# Altium project TAUV-Modem.PrjPcb
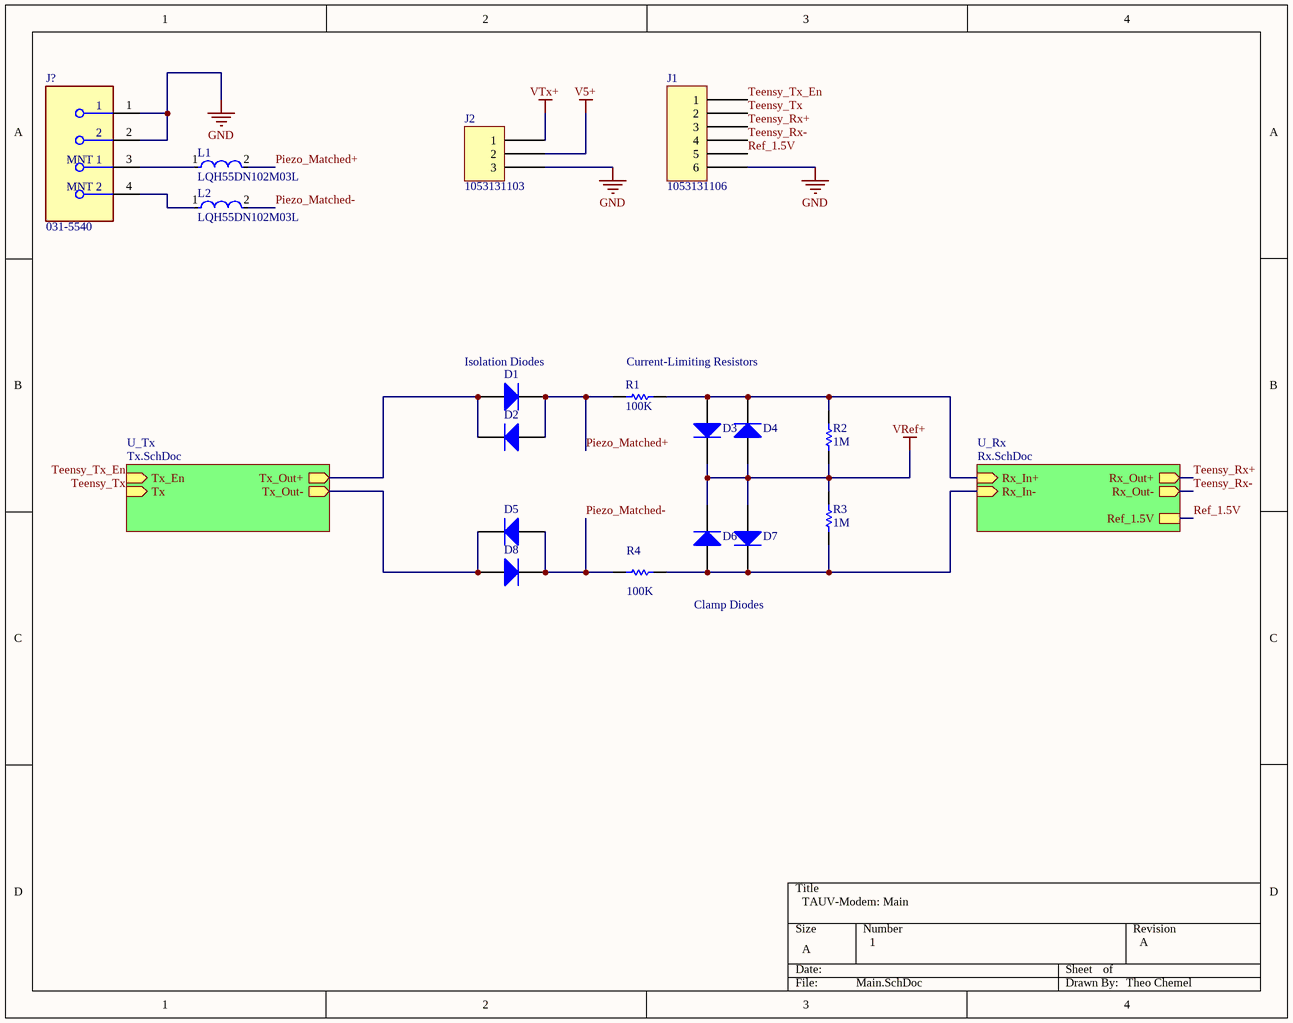
[diagram p0: Main.SchDoc]
3 sheets, 79 parts. Net scope: hierarchical (ports join the sheet entries above them; power ports are global).
Board file: TAUV-Modem-Board.PcbDoc
Sheets:
  Main.SchDoc
    U_Tx = Tx.SchDoc
    U_Rx = Rx.SchDoc

## Sheet Main.SchDoc: TAUV-Modem: Main
size A; DrawnBy: Theo Chemel; Revision: A; SheetNumber: 1; SheetTotal: 3

### Parts
D1  Diode  [SOD-123F]  (value not drawn)
D2  Diode  [SOD-123F]  (value not drawn)
D3  Diode  [SOD-123F]  (value not drawn)
D4  Diode  [SOD-123F]  (value not drawn)
D5  Diode  [SOD-123F]  (value not drawn)
D6  Diode  [SOD-123F]  (value not drawn)
D7  Diode  [SOD-123F]  (value not drawn)
D8  Diode  [SOD-123F]  (value not drawn)
J1  1053131106  [MOLEX 1053131106]
J2  1053131103  [MOLEX 1053131103]
J3  031-5540  [FP-031-5540-MFG]
L1  LQH55DN102M03L  [FP-LQH55DN_03-MFG]
L2  LQH55DN102M03L  [FP-LQH55DN_03-MFG]
R1  value 100K  [0805]  (hidden comment: Resistor)
R2  value 1M  [0805]  (hidden comment: Resistor)
R3  value 1M  [0805]  (hidden comment: Resistor)
R4  value 100K  [0805]  (hidden comment: Resistor)

### Sub-sheets
U_Rx = Rx.SchDoc: Rx_In+ (in), Rx_In- (in), Ref_1.5V, Rx_Out+ (out), Rx_Out- (out)
U_Tx = Tx.SchDoc: Tx_En (in), Tx (in), Tx_Out+ (out), Tx_Out- (out)

### Nets
GND: J1.6 J2.3 J3.1 J3.2
V5+: J2.2
VRef+: D3.2(K) D4.1(A) D6.2(K) D7.1(A) R2.1 R3.2
VTx+: J2.1
Piezo_Matched+: D1.2(K) D2.1(A) L1.2 R1.1
Piezo_Matched-: D5.1(A) D8.2(K) L2.2 R4.1
Ref_1.5V: J1.5 ; sheet U_Rx/Ref_1.5V  [project net AD8338_VREF]
Teensy_Rx+: J1.3 ; sheet U_Rx/Rx_Out+  [project net Rx_Out+]
Teensy_Rx-: J1.4 ; sheet U_Rx/Rx_Out-  [project net Rx_Out-]
Teensy_Tx: J1.2 ; sheet U_Tx/Tx
Teensy_Tx_En: J1.1 ; sheet U_Tx/Tx_En
Tx_Out+: D1.1(A) D2.2(K) ; sheet U_Tx/Tx_Out+
Tx_Out-: D5.2(K) D8.1(A) ; sheet U_Tx/Tx_Out-
NetD3_1: D3.1(A) D4.2(K) R1.2 R2.2 ; sheet U_Rx/Rx_In+
NetD6_1: D6.1(A) D7.2(K) R3.1 R4.2 ; sheet U_Rx/Rx_In-
NetJ3_3: J3.3(MNT_1) L1.1
NetJ3_4: J3.4(MNT_2) L2.1

### Notes on the sheet
- (near D1) Isolation Diodes
- (near R1) Current-Limiting Resistors
- Clamp Diodes

### Library data of the parts
D1-D8 = Diode: AF: 1; BV: 0; BV_MAX: 1e99; EG: 1.11; FC: 0.5; IBV: 0.001; ISR: 1e-14; MJSW: 0.33; NTUN: 30; TNOM: 27; XTI: 3; SimulationGenericComponent: True; CJO: 0; CJP: 0; CTA: 0; CTP: 0; FCS: 0.5; FV_MAX: 1e99; IKF: 0; IKR: 0; JSW: 0; JTUN: 0; JTUNSW: 0; KEG: 1; KF: 0; LEVEL: 1; N: 1; NBV: 1; NR: 1; NS: 1; PHP: 1; RS: 0; TCV: 0; TLEV: 0; TLEVC: 0; TM1: 0; TM2: 0; TPB: 0; TPHP: 0; TRS: 0; TRS2: 0; TT: 0; TTT1: 0; TTT2: 0; VJ: 1; XTITUN: 3; IS: 1e-14
J1 = 1053131106: CONN HEADER R/A 6POS 2.5MM; Manufacturer: Molex; Contact Length - Post: 0.126" (3.20mm); Number of Positions: 6; Number of Positions Loaded: All; Pitch - Mating: 0.098" (2.50mm); Row Spacing - Mating: -40°C ~ 105°C; Shrouding: Shrouded - 4 Wall; Style: Board to Cable/Wire; Part Number: 1053131106; ComponentLink1Description: Datasheet; ComponentLink1URL: https://www.molex.com/pdm_docs/ps/PS-105300-100-001.pdf; ComponentLink2Description: DigiKey Link; ComponentLink2URL: https://www.digikey.com/en/products/detail/molex/1053131106/7693178; Connector Type: Header; Contact Finish - Mating: Tin; Contact Finish - Post: Tin; Contact Finish Thickness - Mating: 59.0µin (1.50µm); Contact Material: Brass; Contact Shape: Square; Contact Type: Male Pin; Fastening Type: Latch Holder; Features: Board Guide; Insulation Color: Black; Insulation Height: 0.149" (3.78mm); Insulation Material: Liquid Crystal Polymer (LCP); LastUpdated: 8/11/2022 9:49:49 AM; Lifecycle Status: Active; Minimum Order: 1; Mounting Type: Through Hole, Right Angle; Number of Rows: 1; Operating Temperature: -40°C ~ 105°C; Packaging: Tray; PartId: 145; Part Status: Active; Price: 0.75; Series: Nano-Fit 105313; Supplier 1: DigiKey; Supplier Part Number 1: WM16897-ND; Termination: Solder
J2 = 1053131103: CONN HEADER R/A 3POS 2.5MM; Manufacturer: Molex; Contact Length - Post: 0.126" (3.20mm); Number of Positions: 3; Number of Positions Loaded: All; Pitch - Mating: 0.098" (2.50mm); Row Spacing - Mating: -40°C ~ 105°C; Shrouding: Shrouded - 4 Wall; Style: Board to Cable/Wire; Part Number: 1053131103; ComponentLink1Description: Datasheet; ComponentLink1URL: http://www.literature.molex.com/SQLImages/kelmscott/Molex/PDF_Images/987651-1223.PDF; ComponentLink2Description: DigiKey Link; ComponentLink2URL: http://digikey.com/product-detail/en/molex/1053131103/WM16894-ND/7693175; Connector Type: Header; Contact Finish - Mating: Tin; Contact Finish - Post: Tin; Contact Finish Thickness - Mating: 59.0µin (1.50µm); Contact Material: Brass; Contact Shape: Square; Contact Type: Male Pin; Fastening Type: Latch Holder; Features: Board Guide; Insulation Color: Black; Insulation Height: 0.149" (3.78mm); Insulation Material: Liquid Crystal Polymer (LCP); LastUpdated: 8/11/2022 9:48:02 AM; Lifecycle Status: Active; Minimum Order: 1; Mounting Type: Through Hole, Right Angle; Number of Rows: 1; Operating Temperature: -40°C ~ 105°C; Packaging: Tray; PartId: 142; Part Status: Active; Price: 0.95; Series: Nano-Fit 105313; Supplier 1: DigiKey; Supplier Part Number 1: WM16894-ND; Termination: Solder
J3 = CMP-20040-000002-1: CONN BNC RCPT R/A 50 OHM PCB; Manufacturer: Amphenol RF; Impedance: 50Ω; Number Of Contacts: 2; Pitch: 2.54mm; Dielectric Material: Polypropylene; Is Female: yes; Frequency: 1GHz; Conn Orientation: Right Angle; Lead Free: Yes; Device Class L2: RF / Coaxial Connectors; Digikey Description: CONN BNC RCPT R/A 50 OHM PCB; Octopart: https://octopart.com/031-5540-amphenol+rf-49742301; ComponentLink2URL: https://www.amphenolrf.com/downloads/dl/file/id/2040/product/579/031_5540_customer_drawing.pdf; Package: 0; Automotive: No; Temperature: -55°C to +85°C; Contact Material: Gold,Nickel; RoHS: TRUE; ComponentLink2Description: Datasheet; Height: 13.4mm; Category: Conn; Manufacturer Part Number: 031-5540; Temperature Range High: +85°C; Device Class L3: unset; Temperature Range Low: -55°C; Device Class L1: Connectors
L1 L2 = CMP-06042-004467-1: Wire Wound Ferrite Inductor for Power Lines 1000μH ±20% 14.42Ω  0.15A 2220; Series Resistance: 10.3R; Self Resonant Frequency: 1.7MHz; Test Frequency: 10kHz; Shielding: Unshielded; Max DC Current: 150mA; Inductance: 1mH; Weight: 0.016932oz; Tolerance: 20%; Max Operating Temperature: 80°C; DC Resistance (DCR): 10.3R; Military Standard: Not; Height - Seated (Max): 0.198inch; Radiation Hardening: No; Min Operating Temperature: -40°C; Lead Free: Lead Free; Case/Package: 2220; Width: 0.197inch; Resistor Type: Wirewound; Depth: 5.3mm; Termination: SMD/SMT; Case Code (Metric): 5750; Height: 0.197inch; Case Code (Imperial): 2220; Core Material: Ferrite; Package Quantity: 350; Mount: Surface Mount; Packaging: Tape and Reel; Current Rating: 150mA; DC Current: 150mA; Length: 0.224inch
R1-R4 = Resistor: TC1: 0; SimulationGenericComponent: True; TC2: 0

## Sheet Tx.SchDoc
size A; SheetNumber: 2; SheetTotal: 3; SPICEModelCacheFIXEDSUJ: <root> / <DocumentId>FIXEDSUJ</DocumentId> / </root>
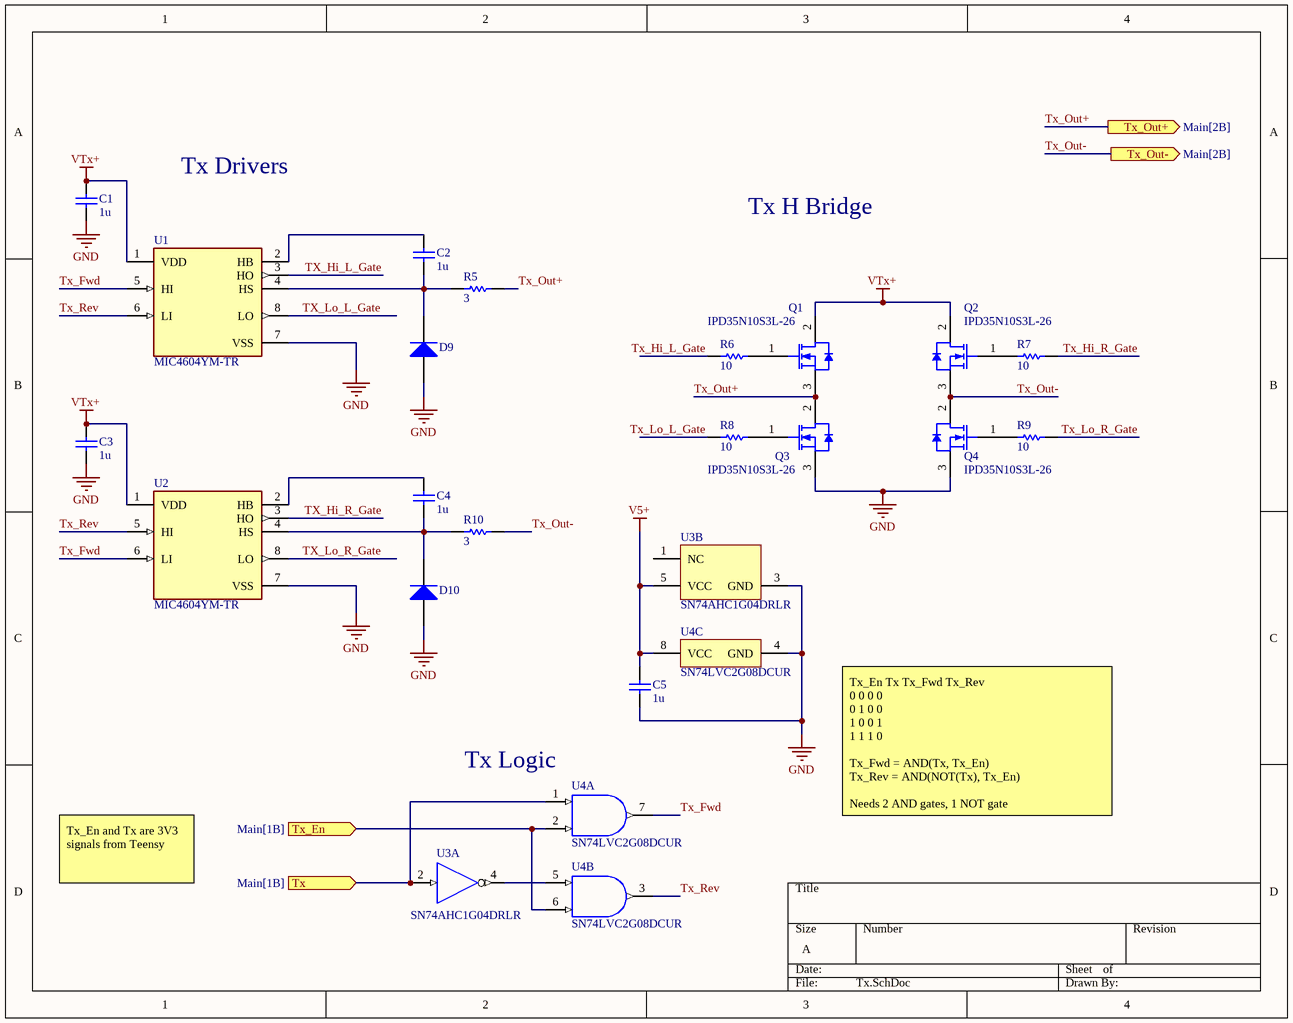
[diagram p1: Tx.SchDoc]

### Parts
C1  value 1u  [0805]  (hidden comment: Capacitor)
C2  value 1u  [0805]  (hidden comment: Capacitor)
C3  value 1u  [0805]  (hidden comment: Capacitor)
C4  value 1u  [0805]  (hidden comment: Capacitor)
C5  value 1u  [0805]  (hidden comment: Capacitor)
D9  Diode  [SOD-123F]  (value not drawn)
D10  Diode  [SOD-123F]  (value not drawn)
Q1  IPD35N10S3L-26  [INF-PG-TO252-3-11_M]
Q2  IPD35N10S3L-26  [INF-PG-TO252-3-11_M]
Q3  IPD35N10S3L-26  [INF-PG-TO252-3-11_M]
Q4  IPD35N10S3L-26  [INF-PG-TO252-3-11_M]
R5  value 3  [0805]  (hidden comment: Resistor)
R6  value 10  [0805]  (hidden comment: Resistor)
R7  value 10  [0805]  (hidden comment: Resistor)
R8  value 10  [0805]  (hidden comment: Resistor)
R9  value 10  [0805]  (hidden comment: Resistor)
R10  value 3  [0805]  (hidden comment: Resistor)
U1  MIC4604YM-TR  [FP-SOICN-8LD-PL-1-IPC_A]
U2  MIC4604YM-TR  [FP-SOICN-8LD-PL-1-IPC_A]
U3  SN74AHC1G04DRLR  [DRL0005A_M]  (parts A,B of 2)
U4  SN74LVC2G08DCUR  [DCU0008A_M]  (parts A,B,C of 3)

### Ports
Tx (in, see Main[1B]), Tx_En (in, see Main[1B]), Tx_Out+ (out, see Main[2B]), Tx_Out- (out, see Main[2B])

### Nets
GND: C1.1 C3.1 C5.1 D9.1(A) D10.1(A) Q3.3(SOURCE) Q4.3(SOURCE) U1.7(VSS) U2.7(VSS) U3.3(GND) U4.4(GND)
V5+: C5.2 U3.5(VCC) U4.8(VCC)
VTx+: C1.2 C3.2 Q1.2(DRAIN) Q2.2(DRAIN) U1.1(VDD) U2.1(VDD)
Teensy_Tx: U3.2(A) U4.1(1A) ; port Tx
Teensy_Tx_En: U4.2(1B) U4.6(2B) ; port Tx_En
Tx_Fwd: U1.5(HI) U2.6(LI) U4.7(1Y)
Tx_Hi_L_Gate: R6.1 U1.3(HO)
Tx_Hi_R_Gate: R7.2 U2.3(HO)
Tx_Lo_L_Gate: R8.1 U1.8(LO)
Tx_Lo_R_Gate: R9.2 U2.8(LO)
Tx_Out+: Q1.3(SOURCE) Q3.2(DRAIN) R5.2 ; port Tx_Out+
Tx_Out-: Q2.3(SOURCE) Q4.2(DRAIN) R10.2 ; port Tx_Out-
Tx_Rev: U1.6(LI) U2.5(HI) U4.3(2Y)
NetC2_1: C2.1 D9.2(K) R5.1 U1.4(HS)
NetC2_2: C2.2 U1.2(HB)
NetC4_1: C4.1 D10.2(K) R10.1 U2.4(HS)
NetC4_2: C4.2 U2.2(HB)
NetQ1_1: Q1.1(GATE) R6.2
NetQ2_1: Q2.1(GATE) R7.1
NetQ3_1: Q3.1(GATE) R8.2
NetQ4_1: Q4.1(GATE) R9.1
NetU3_4: U3.4(Y) U4.5(2A)

Not connected (* = marked no-connect by the designer): U3 1(NC)

### Notes on the sheet
- Tx Drivers
- Tx H Bridge
- (near U4) Tx Logic
- Tx_En Tx Tx_Fwd Tx_Rev
  0 0 0 0
  0 1 0 0
  1 0 0 1
  1 1 1 0
  Tx_Fwd = AND(Tx, Tx_En)
  Tx_Rev = AND(NOT(Tx), Tx_En)
  Needs 2 AND gates, 1 NOT gate
- Tx_En and Tx are 3V3 signals from Teensy

### Library data of the parts
C1-C5 = Capacitor: SimulationGenericComponent: True
D9 D10 = Diode: as D1 on sheet Main; CJO: 0; CJP: 0; CTA: 0; CTP: 0; FCS: 0.5; FV_MAX: 1e99; IKF: 0; IKR: 0; JSW: 0; JTUN: 0; JTUNSW: 0; KEG: 1; KF: 0; LEVEL: 1; N: 1; NBV: 1; NR: 1; NS: 1; PHP: 1; RS: 0; TCV: 0; TLEV: 0; TLEVC: 0; TM1: 0; TM2: 0; TPB: 0; TPHP: 0; TRS: 0; TRS2: 0; TT: 0; TTT1: 0; TTT2: 0; VJ: 1; XTITUN: 3; IS: 1e-14
Q1-Q4 = CMP-1138-00144-1: OptiMOS-T Power-Transistor, 100 V VDS, 35 A ID, PG-TO252-3-11, Reel, Green; Manufacturer: Infineon; VGS(th) (max): 2.4 V; ID (max): 35 A; RthJC (max): 2.1 K/W; RDS (on) (max) (@10V): 24 mOhm; VDS (max): 100 V; Green: TRUE; VGS(th) (min): 1.2 V; QG: 39 nC; RDS (on) (max) (@4.5V): 31.9 mOhm; IDpuls (max): 140 A; Ptot (max): 71 W; ComponentLink1URL: http://www.infineon.com/; ComponentLink1Description: Manufacturer URL; ComponentLink3URL: http://www.infineon.com/dgdl/BTS142_DS_13.pdf?folderId=db3a3043163797a6011667aa084c0e01&fileId=db3a3043163797a6011667ac98be0e02&location=en.Products.Automotive_ICs.Smart_High-_and_Low-Side_Switches.HITFET___TEMPFET__-_Smart_Low-Side_Switches.DATASHEET.BTS1; Packing: Reel; ComponentLink3Description: Package Specification; PackageReference: PG-TO252-3-11; ComponentLink2URL: http://www.infineon.com/dgdl/IPD35N10S3L-26_DS_1_1.pdf?folderId=db3a3043156fd5730115c7d50620107c&fileId=db3a30431a5c32f2011a9085629c594b&location=en.Products.Automotive_ICs.Automotive_MOSFETs.Single__N-Channel_100V_MOSFETs.DATASHEET.IPD35N10S3L-26_DS_1_1.p; ComponentLink2Description: Datasheet; DatasheetVersion: Rev.1.1; Mounting Technology: Surface Mount; PartNumber: IPD35N10S3L-26; PackageVersion: Dec-06; PackageDescription: 3-Pin Plastic (Green) Transistor Single Outline Package, 6.5 x 6.12 mm Body, 2.28 mm Pitch; Technology: OptiMOS-T; Halogen-free: TRUE
R5-R10 = Resistor: TC1: 0; SimulationGenericComponent: True; TC2: 0
U1 U2 = CMP-06319-000039-1: IC GATE DRVR HALF-BRIDGE 8SOIC; Min Supply Voltage: 5.5V; Max Supply Voltage: 16V; Turn-On Delay Time: 75ns; Rise Time: 20ns; Number of Drivers: 2; Operating Supply Voltage: 12V; Number of Outputs: 1; Nominal Supply Current: 48uA; Max Output Current: 1A; Channel Type: Independent; Packaging: Tape and Reel; Turn-Off Delay Time: 75ns; Number of Pins: 8; Fall Time: 20ns; Max Operating Temperature: 125°C; Min Operating Temperature: -40°C; Package Quantity: 2500; Lead Free: Lead Free; Supply Current: 48uA; Mount: Surface Mount; RoHS Compliant: Yes; Series: -; Case/Package: SOIC
U3 = CMP-0859-00797-3: Single Inverter Gate, DRL0005A, LARGE T&R; Manufacturer: Texas Instruments; VCC(Min)(V): 2; F @ Nom Voltage(Max)(Mhz): 75; VCC(Max)(V): 5.5; Output Type: CMOS; Voltage(Nom)(V): 3.3,5; Schmitt Trigger: No; Logic: Inverting; Technology Family: AHC; tpd @ Nom Voltage(Max)(ns): 10.6,7.5; Rating: Catalog; Sub-Family: Inverting Buffer/Driver; Output Drive (IOL/IOH)(Max)(mA): 50/-50; ICC @ Nom Voltage(Max)(mA): 0.01; Bits(#): 1; PackageReference: DRL0005A; Operating Temperature Range(C): -40 to 125; Input Type: CMOS; Generic Part Number: SN74AHC1G04; DatasheetVersion: SCLS318S; 3-State Output: No
U4 = CMP-0859-00670-3: Dual 2-Input Positive-AND Gate, DCU0008A, LARGE T&R; Manufacturer: Texas Instruments; Logic: True; Output Drive (IOL/IOH)(Max)(mA): 32/-32; F @ Nom Voltage(Max)(Mhz): 150; Technology Family: LVC; Rating: Catalog; tpd @ Nom Voltage(Max)(ns): 9.8,5.8,5.3,4.8; Voltage(Nom)(V): 1.8,2.5,3.3,5; Schmitt Trigger: No; Input Type: CMOS/TTL; Bits(#): 2; Gate Type: AND; VCC(Max)(V): 5.5; VCC(Min)(V): 1.65; ICC @ Nom Voltage(Max)(mA): 0.01; Output Type: CMOS; Sub-Family: AND Gate; PackageReference: DCU0008A; Operating Temperature Range(C): -40 to 125,-40 to 85; 3-State Output: No; DatasheetVersion: SCES198M; Generic Part Number: SN74LVC2G08

## Sheet Rx.SchDoc
size A; SheetNumber: 3; SheetTotal: 3
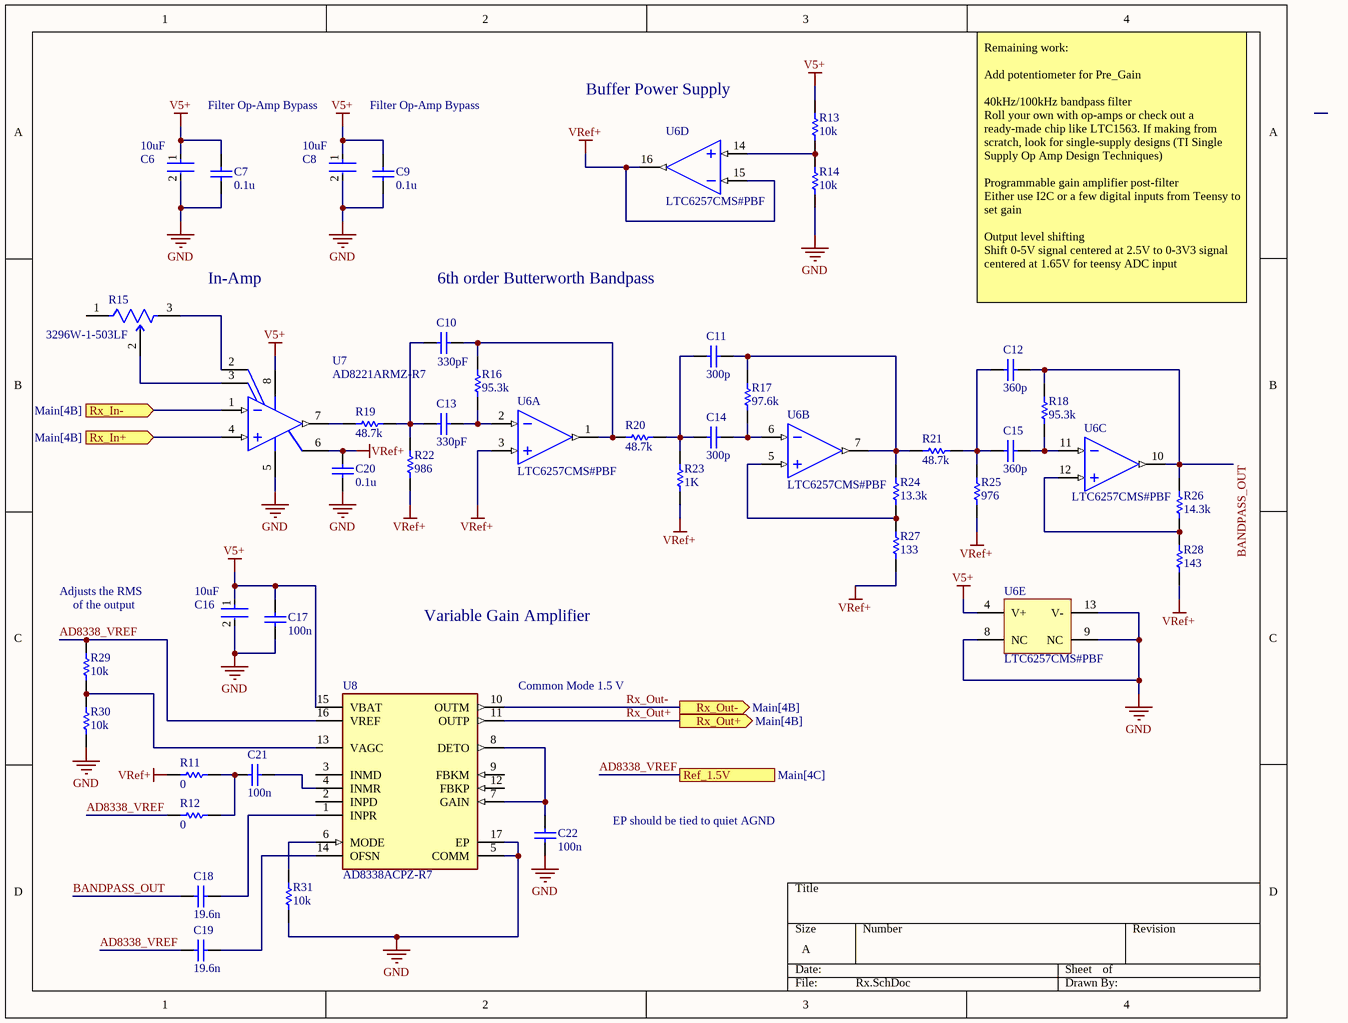
[diagram p2: Rx.SchDoc]

### Parts
C6  Capacitance: 10uF  [FP-C3216-160-0_2-IPC_A]  (hidden comment: C3216X5R1H106K160AB)
C7  value 0.1u  [0805]  (hidden comment: Capacitor)
C8  Capacitance: 10uF  [FP-C3216-160-0_2-IPC_A]  (hidden comment: C3216X5R1H106K160AB)
C9  value 0.1u  [0805]  (hidden comment: Capacitor)
C10  value 330pF  [0805]  (hidden comment: Capacitor)
C11  value 300p  [0805]  (hidden comment: Capacitor)
C12  value 360p  [0805]  (hidden comment: Capacitor)
C13  value 330pF  [0805]  (hidden comment: Capacitor)
C14  value 300p  [0805]  (hidden comment: Capacitor)
C15  value 360p  [0805]  (hidden comment: Capacitor)
C16  Capacitance: 10uF  [FP-C3216-160-0_2-IPC_A]  (hidden comment: C3216X5R1H106K160AB)
C17  value 100n  [0805]  (hidden comment: Capacitor)
C18  value 19.6n  [0805]  (hidden comment: Capacitor)
C19  value 19.6n  [0805]  (hidden comment: Capacitor)
C20  value 0.1u  [0805]  (hidden comment: Capacitor)
C21  value 100n  [0805]  (hidden comment: Capacitor)
C22  value 100n  [0805]  (hidden comment: Capacitor)
R11  value 0  [0805]  (hidden comment: Resistor)
R12  value 0  [0805]  (hidden comment: Resistor)
R13  value 10k  [0805]  (hidden comment: Resistor)
R14  value 10k  [0805]  (hidden comment: Resistor)
R15  3296W-1-503LF  [FP-3296W-MFG]
R16  value 95.3k  [0805]  (hidden comment: Resistor)
R17  value 97.6k  [0805]  (hidden comment: Resistor)
R18  value 95.3k  [0805]  (hidden comment: Resistor)
R19  value 48.7k  [0805]  (hidden comment: Resistor)
R20  value 48.7k  [0805]  (hidden comment: Resistor)
R21  value 48.7k  [0805]  (hidden comment: Resistor)
R22  value 986  [0805]  (hidden comment: Resistor)
R23  value 1K  [0805]  (hidden comment: Resistor)
R24  value 13.3k  [0805]  (hidden comment: Resistor)
R25  value 976  [0805]  (hidden comment: Resistor)
R26  value 14.3k  [0805]  (hidden comment: Resistor)
R27  value 133  [0805]  (hidden comment: Resistor)
R28  value 143  [0805]  (hidden comment: Resistor)
R29  value 10k  [0805]  (hidden comment: Resistor)
R30  value 10k  [0805]  (hidden comment: Resistor)
R31  value 10k  [0805]  (hidden comment: Resistor)
U6  LTC6257CMS#PBF  [LT-MS-16_N]  (parts A,B,C,D,E of 5)
U7  AD8221ARMZ-R7  [ADI-RM-8_L]
U8  AD8338ACPZ-R7  [FP-CP-16-22-IPC_C]

### Ports
Ref_1.5V (see Main[4C]), Rx_In+ (in, see Main[4B]), Rx_In- (in, see Main[4B]), Rx_Out+ (out, see Main[4B]), Rx_Out- (out, see Main[4B])

### Nets
GND: C6.2 C7.1 C8.2 C9.1 C16.2 C17.1 C20.1 C22.1 R14.1 R30.1 R31.1 U6.8(NC) U6.9(NC) U6.13(V-) U7.5(VS-) U8.5(COMM) U8.17(EP)
V5+: C6.1 C7.2 C8.1 C9.2 C16.1 C17.2 R13.2 U6.4(V+) U7.8(VS+) U8.15(VBAT)
VRef+: C20.2 R11.2 R22.1 R23.1 R25.1 R27.1 R28.1 U6.3(IN+_A) U6.15(IN-_D) U6.16(OUT_D) U7.6(REF)
AD8338_VREF: C19.2 R12.2 R29.2 U8.16(VREF) ; port Ref_1.5V
BANDPASS_OUT: C12.1 C18.2 R18.2 R26.2 U6.10(OUT_C)
Rx_Out+: U8.11(OUTP) ; port Rx_Out+
Rx_Out-: U8.10(OUTM) ; port Rx_Out-
NetC10_1: C10.1 R16.2 R20.1 U6.1(OUT_A)
NetC10_2: C10.2 C13.2 R19.2 R22.2
NetC11_1: C11.1 R17.2 R21.1 R24.2 U6.7(OUT_B)
NetC11_2: C11.2 C14.2 R20.2 R23.2
NetC12_2: C12.2 C15.2 R21.2 R25.2
NetC13_1: C13.1 R16.1 U6.2(IN-_A)
NetC14_1: C14.1 R17.1 U6.6(IN-_B)
NetC15_1: C15.1 R18.1 U6.11(IN-_C)
NetC18_1: C18.1 U8.1(INPR)
NetC19_1: C19.1 U8.14(OFSN)
NetC21_1: C21.1 U8.4(INMR)
NetC21_2: C21.2 R11.1 R12.1
NetC22_2: C22.2 U8.7(GAIN) U8.8(DETO)
NetD3_1: U7.4(IN+) ; port Rx_In+
NetD6_1: U7.1(IN-) ; port Rx_In-
NetR13_1: R13.1 R14.2 U6.14(IN+_D)
NetR15_2: R15.2(WIPER) U7.3(RG)
NetR15_3: R15.3(CW) U7.2(RG)
NetR19_1: R19.1 U7.7(VOUT)
NetR24_1: R24.1 R27.2 U6.5(IN+_B)
NetR26_1: R26.1 R28.2 U6.12(IN+_C)
NetR29_1: R29.1 R30.2 U8.13(VAGC)
NetR31_2: R31.2 U8.6(MODE)

Not connected (* = marked no-connect by the designer): R15 1(CCW); U8 2(INPD) 3(INMD) 9(FBKM) 12(FBKP)

### Notes on the sheet
- Buffer Power Supply
- Filter Op-Amp Bypass
- In-Amp
- 6th order Butterworth Bandpass
- Remaining work:
  Add potentiometer for Pre_Gain
  40kHz/100kHz bandpass filter
  Roll your own with op-amps or check out a ready-made chip like LTC1563. If making from scratch, look for single-supply designs (TI Single Supply Op Amp Design Techniques)
  Programmable gain amplifier post-filter
  Either use I2C or a few digital inputs from Teensy to set gain
  Output level shifting
  Shift 0-5V signal centered at 2.5V to 0-3V3 signal centered at 1.65V for teensy ADC input
- Adjusts the RMS
- (near R29) of the output
- Variable Gain Amplifier
- (near U8) Common Mode 1.5 V
- EP should be tied to quiet AGND

### Library data of the parts
C6 C8 C16 = CMP-2000-06045-2: Multilayer Ceramic Capacitors 10uF ±10% 50V X5R SMD 1206; Min Operating Temperature: -55°C; Weight: 0.000571oz; Tolerance: 10%; Lead Free: Lead Free; REACH SVHC: No SVHC; Dielectric Material: Ceramic; Termination: SMD/SMT; Radiation Hardening: No; Case Code (Metric): 3216; Max Operating Temperature: 85°C; Voltage Rating (DC): 50V; Packaging: Tape and Reel; Height: 1.6mm; Voltage: 50V; Dielectric: X5R; Mount: Surface Mount; Voltage Rating: 50V; Length: 3.2mm; RoHS Compliant: Yes; Thickness: 0.071inch; Depth: 1.6mm; Width: 0.063inch; Case/Package: 1206; Series: C; Package Quantity: 1; Resistor Type: Ceramic; Case Code (Imperial): 1206; Construction: Flat
C7 C9-C15 C17-C22 = Capacitor: SimulationGenericComponent: True
R11 R12 = Resistor: SimulationGenericComponent: True; TC1: 0; TC2: 0
R13 R14 R16-R18 R21-R31 = Resistor: TC1: 0; SimulationGenericComponent: True; TC2: 0
R15 = CMP-07234-000043-1: TRIMMER 50K OHM 0.5W PC PIN TOP; Manufacturer Series: 3296; Resistance Tolerance: 10%; Actuator Orientation: Vertical; Resistance: 50kR; Number of Turns: 25; Power Rating: 500mW; Insulation Resistance: 1GR; Actuator Type: SCREW; Resistance Law: Linear; Number of Terminals/Pins: 3; Temperature Coefficient: 100ppm/°C; Weight: 0.03oz; Length: 9.53mm; Package Quantity: 50; Resistor Type: Cermet; Min Operating Temperature: -55°C; Termination: Pin; Radiation Hardening: No; Terminal Finish: Tin; Height: 0.395inch; Depth: 4.83mm; REACH SVHC: No SVHC; Width: 9.53mm; Packaging: Rail/Tube; RoHS Compliant: Yes; Mount: Panel; Max Power Dissipation: 500mW; Taper: Linear; Color: Blue; Technology: CERMET; Lead Free: Lead Free; Max Operating Temperature: 125°C; Number of Pins: 3; Type: Potentiometer; Military Standard: Not; Contact Plating: Tin; Series: 3296; Tolerance: 10%
R19 R20 = Resistor: Fixed Resistor, Metal Glaze/thick Film, 0.125W, 48700ohm, 150V, 1% +/-Tol, 100ppm/Cel, Surface Mount, 0805; Manufacturer: Panasonic; Manufacturer Part Number: ERJ-6ENF4872V; TC1: 0; SimulationGenericComponent: True; Power: 125mW; Temperature Coefficient: 100ppm/°C; Rated Temperature: 70°C; Package Height: 0.6mm; Package Length: 2mm; Package Width: 1.25mm; Reference Standard: AEC-Q200; TC2: 0; Supplier: Mouser; Supplier Part Number: 667-ERJ-6ENF4872V; RoHS: Yes; Category: Chip SMD Resistors; Stock: 62583; Pricing: 1=0.11000, 10=0.08900, 50=0.08900, 100=0.03500, 1000=0.01600, 10000=0.01100 (USD); Mounting Technology: Surface Mount; Pins: 2; Case/Package: 0805; Terminal Finish: Nickel; Package Shape: Rectangular; Min Operating Temperature: -55°C; Max Operating Temperature: 155°C; Tolerance: 1%; Resistor Type: FIXED RESISTOR; Packaging: Tape and Reel; Technology: METAL GLAZE/THICK FILM; Termination: Wraparound; Working Voltage: 150V; Construction: Rectangular; Package Style: SMTMeter; JESD-609 Code: e3; RoHS Compliant: Yes; Reach SVHC Compliant: Yes; ComponentLink1URL: https://datasheet.ciiva.com:443/pdfs/VipMasterIC/IC/PANA/PANA-S-A0009889626/PANA-S-A0009889626-1.pdf?src-supplier=IHS+Markit; ComponentLink1Description: https://datasheet.ciiva.com:443/pdfs/VipMasterIC/IC/PANA/PANA-S-A0009889626/PANA-S-A0009889626-1.pdf?src-supplier=IHS+Markit; ComponentLink2URL: https://datasheet.ciiva.com/9189/aoa0000ce2-9189241.pdf?src-supplier=Avnet; ComponentLink2Description: https://datasheet.ciiva.com/9189/aoa0000ce2-9189241.pdf?src-supplier=Avnet; ComponentLink3URL: https://datasheet.ciiva.com/46420/1678782-46420077.pdf?src-supplier=Element14; ComponentLink3Description: https://datasheet.ciiva.com/46420/1678782-46420077.pdf?src-supplier=Element14; ComponentLink4URL: https://datasheet.ciiva.com/22668/1678782-22668698.pdf?src-supplier=Element14; ComponentLink4Description: https://datasheet.ciiva.com/22668/1678782-22668698.pdf?src-supplier=Element14; ComponentLink5URL: https://datasheet.ciiva.com/24063/aoa0000ce2-24063086.pdf?src-supplier=Mouser; ComponentLink5Description: https://datasheet.ciiva.com/24063/aoa0000ce2-24063086.pdf?src-supplier=Mouser
U6 = CMP-0359-00487-2: Quad Channel, Power Efficient Operational Amplifier, RRIO, 6.5 MHz Typical GBW, 1.8 V/us Typical SR, 1.8 to 5.25 V, 16-Pin SOP (MS16), Commercial, Pb-Free; Manufacturer: Linear Technology; Manufacturer Part Number: ERJ-6ENF4872V; Vs Max (V): 5.25; GBW (MHz) Typical: 6.5; Is (mA) Typical: 0.065; SR (V/us) Typical: 1.8; Vos (mV) Typical: 0.1; Channels (#): 4; Description: Fixed Resistor, Metal Glaze/thick Film, 0.125W, 48700ohm, 150V, 1% +/-Tol, 100ppm/Cel, Surface Mount, 0805; Tolerance: 1%; Power: 125mW; Value: 48.7kR; Temperature Coefficient: 100ppm/°C; Working Voltage: 150V; Rated Temperature: 70°C; Package Height: 0.6mm; Package Length: 2mm; Package Width: 1.25mm; Reference Standard: AEC-Q200; ComponentLink3URL: http://cds.linear.com/docs/en/packaging/MSOP_16_05-08-1669.pdf; PackageReference: LT-MS-16; ComponentLink2Description: Datasheet; PackageDescription: 16-Lead Plastic MSOP, Body 4.04 x 3.00 mm, Pitch 0.50 mm; Type: VFB; ComponentLink3Description: Package Specification; Mounting Technology: Surface Mount; ComponentLink1URL: http://www.linear.com/; DatasheetVersion: Rev. B; PartNumber: LTC6257CMS#PBF; RoHS: Pb-Free; Linear Technology Part Number: LTC6257; PackageVersion: Rev Ã˜; Vs Min (V): 1.8; ComponentLink2URL: http://cds.linear.com/docs/en/datasheet/625567fb.pdf; ComponentLink1Description: Manufacturer URL; RevisionNote: URLs updated; Supplier: Mouser; Supplier Part Number: 667-ERJ-6ENF4872V; Category: Chip SMD Resistors; Stock: 62583; Pricing: 1=0.11000, 10=0.08900, 50=0.08900, 100=0.03500, 1000=0.01600, 10000=0.01100 (USD); Pins: 2; Case/Package: 0805; Terminal Finish: Nickel; Package Shape: Rectangular; Min Operating Temperature: -55°C; Max Operating Temperature: 155°C; Resistor Type: FIXED RESISTOR; Packaging: Tape and Reel; Technology: METAL GLAZE/THICK FILM; Termination: Wraparound; Construction: Rectangular; Package Style: SMTMeter; JESD-609 Code: e3; RoHS Compliant: Yes; Reach SVHC Compliant: Yes; ComponentLink4URL: https://datasheet.ciiva.com:443/pdfs/VipMasterIC/IC/PANA/PANA-S-A0009889626/PANA-S-A0009889626-1.pdf?src-supplier=IHS+Markit; ComponentLink4Description: https://datasheet.ciiva.com:443/pdfs/VipMasterIC/IC/PANA/PANA-S-A0009889626/PANA-S-A0009889626-1.pdf?src-supplier=IHS+Markit; ComponentLink5URL: https://datasheet.ciiva.com/9189/aoa0000ce2-9189241.pdf?src-supplier=Avnet; ComponentLink5Description: https://datasheet.ciiva.com/9189/aoa0000ce2-9189241.pdf?src-supplier=Avnet; ComponentLink6URL: https://datasheet.ciiva.com/46420/1678782-46420077.pdf?src-supplier=Element14; ComponentLink6Description: https://datasheet.ciiva.com/46420/1678782-46420077.pdf?src-supplier=Element14; ComponentLink7URL: https://datasheet.ciiva.com/22668/1678782-22668698.pdf?src-supplier=Element14; ComponentLink7Description: https://datasheet.ciiva.com/22668/1678782-22668698.pdf?src-supplier=Element14; ComponentLink8URL: https://datasheet.ciiva.com/24063/aoa0000ce2-24063086.pdf?src-supplier=Mouser; ComponentLink8Description: https://datasheet.ciiva.com/24063/aoa0000ce2-24063086.pdf?src-supplier=Mouser
U7 = CMP-0934-00067-1: Precision Instrumentation Amplifier, 2 V/us, -40 to 125 degC, 8-Pin MSOP (RM-8), RoHS, Tape and Reel; Manufacturer: Analog Devices; -3dB Bandwidth@G: 1=825 kHz; VIO: 60 uV Max.; Quiescent Current: 0.9 mA Typ.; Slew Rate@G: 1=2 V/us Typ.; PartNumber: AD8221ARMZ-R7; ComponentLink3Description: Package Specification; Packing: Tape and Reel; PackageVersion: Aug-05; Temperature Range: -40 to 125 degC; RoHS: TRUE; ComponentLink3URL: http://www.analog.com/static/imported-files/packages/PKG_PDF/MSOP(RM)/RM_8.pdf; PackageDescription: 8-Pin Mini Small Outline Package, Body 3 x 3 mm, Pitch 0.65 mm; ComponentLink1URL: http://www.analog.com/en/index.html; ComponentLink2URL: http://www.analog.com/static/imported-files/data_sheets/AD8221.pdf; ComponentLink2Description: Datasheet; ComponentLink1Description: Manufacturer URL; DatasheetVersion: Rev. C; Mounting Technology: Surface Mount
U8 = CMP-09116-000032-1: IC OPAMP VGA 1 CIRCUIT 16LFCSP; Manufacturer: Analog Devices; Nominal Supply Current: 3-6mA; Max Supply Voltage: 5V; Number Of Channels: 1; Output Current Per Channel: 5mA; Max Junction Temp: +150°C; Min Supply Voltage: 3V; Bandwidth: 18MHz; Voltage Gain: 80dB; Description: Fixed Resistor, Metal Glaze/thick Film, 0.125W, 48700ohm, 150V, 1% +/-Tol, 100ppm/Cel, Surface Mount, 0805; Tolerance: 1%; Power: 125mW; Value: 48.7kR; Temperature Coefficient: 100ppm/°C; Working Voltage: 150V; Rated Temperature: 70°C; Package Height: 0.6mm; Package Length: 2mm; Package Width: 1.25mm; Reference Standard: AEC-Q200; Mouser Description: Special Purpose Amplifiers Ultra Low Pwr 18MHz SGL CH VGA; Device Class L2: Linear ICs; Ipc Land Pattern Name: QFN50P300X300X75-16; Temperature Range Low: -40°C; Device Class L1: Integrated Circuits (ICs); RoHS: TRUE; Digikey Description: IC OPAMP VGA 1 CIRCUIT 16LFCSP; Category: IC; ComponentLink2URL: https://www.analog.com/media/en/technical-documentation/data-sheets/AD8338.pdf; Automotive: No; Height: 0.8mm; Manufacturer Part Number: AD8338ACPZ-R7; Octopart: https://octopart.com/ad8338acpz-r7-analog+devices-21054770; Temperature: -40°C to +85°C; ComponentLink2Description: Datasheet; Lead Free: Yes; Temperature Range High: +85°C; Package: CP-16-22; Device Class L3: Amplifiers - Op Amps; Supplier: Mouser; Supplier Part Number: 667-ERJ-6ENF4872V; Stock: 62583; Pricing: 1=0.11000, 10=0.08900, 50=0.08900, 100=0.03500, 1000=0.01600, 10000=0.01100 (USD); Mounting Technology: Surface Mount; Pins: 2; Case/Package: 0805; Terminal Finish: Nickel; Package Shape: Rectangular; Min Operating Temperature: -55°C; Max Operating Temperature: 155°C; Resistor Type: FIXED RESISTOR; Packaging: Tape and Reel; Technology: METAL GLAZE/THICK FILM; Termination: Wraparound; Construction: Rectangular; Package Style: SMTMeter; JESD-609 Code: e3; RoHS Compliant: Yes; Reach SVHC Compliant: Yes; ComponentLink1URL: https://datasheet.ciiva.com:443/pdfs/VipMasterIC/IC/PANA/PANA-S-A0009889626/PANA-S-A0009889626-1.pdf?src-supplier=IHS+Markit; ComponentLink1Description: https://datasheet.ciiva.com:443/pdfs/VipMasterIC/IC/PANA/PANA-S-A0009889626/PANA-S-A0009889626-1.pdf?src-supplier=IHS+Markit; ComponentLink3URL: https://datasheet.ciiva.com/9189/aoa0000ce2-9189241.pdf?src-supplier=Avnet; ComponentLink3Description: https://datasheet.ciiva.com/9189/aoa0000ce2-9189241.pdf?src-supplier=Avnet; ComponentLink4URL: https://datasheet.ciiva.com/46420/1678782-46420077.pdf?src-supplier=Element14; ComponentLink4Description: https://datasheet.ciiva.com/46420/1678782-46420077.pdf?src-supplier=Element14; ComponentLink5URL: https://datasheet.ciiva.com/22668/1678782-22668698.pdf?src-supplier=Element14; ComponentLink5Description: https://datasheet.ciiva.com/22668/1678782-22668698.pdf?src-supplier=Element14; ComponentLink6URL: https://datasheet.ciiva.com/24063/aoa0000ce2-24063086.pdf?src-supplier=Mouser; ComponentLink6Description: https://datasheet.ciiva.com/24063/aoa0000ce2-24063086.pdf?src-supplier=Mouser

## Nets that join several sheets
GND: Main (J1.6 J2.3 J3.1 J3.2), Tx (11 pins), Rx (17 pins)
V5+: Main (J2.2), Tx (C5.2 U3.5 U4.8), Rx (10 pins)
VRef+: Main (6 pins), Rx (11 pins)
VTx+: Main (J2.1), Tx (6 pins)
AD8338_VREF: Main (J1.5), Rx (C19.2 R12.2 R29.2 U8.16)
NetD3_1: Main (D3.1 D4.2 R1.2 R2.2), Rx (U7.4)
NetD6_1: Main (D6.1 D7.2 R3.1 R4.2), Rx (U7.1)
Rx_Out+: Main (J1.3), Rx (U8.11)
Rx_Out-: Main (J1.4), Rx (U8.10)
Teensy_Tx: Main (J1.2), Tx (U3.2 U4.1)
Teensy_Tx_En: Main (J1.1), Tx (U4.2 U4.6)
Tx_Out+: Main (D1.1 D2.2), Tx (Q1.3 Q3.2 R5.2)
Tx_Out-: Main (D5.2 D8.1), Tx (Q2.3 Q4.2 R10.2)